# Altium schematic sheet sokolov_control_board_2.SchDoc: =title_line_1 + title_line_2
size 840 x 594 mm; SheetNumber: 2
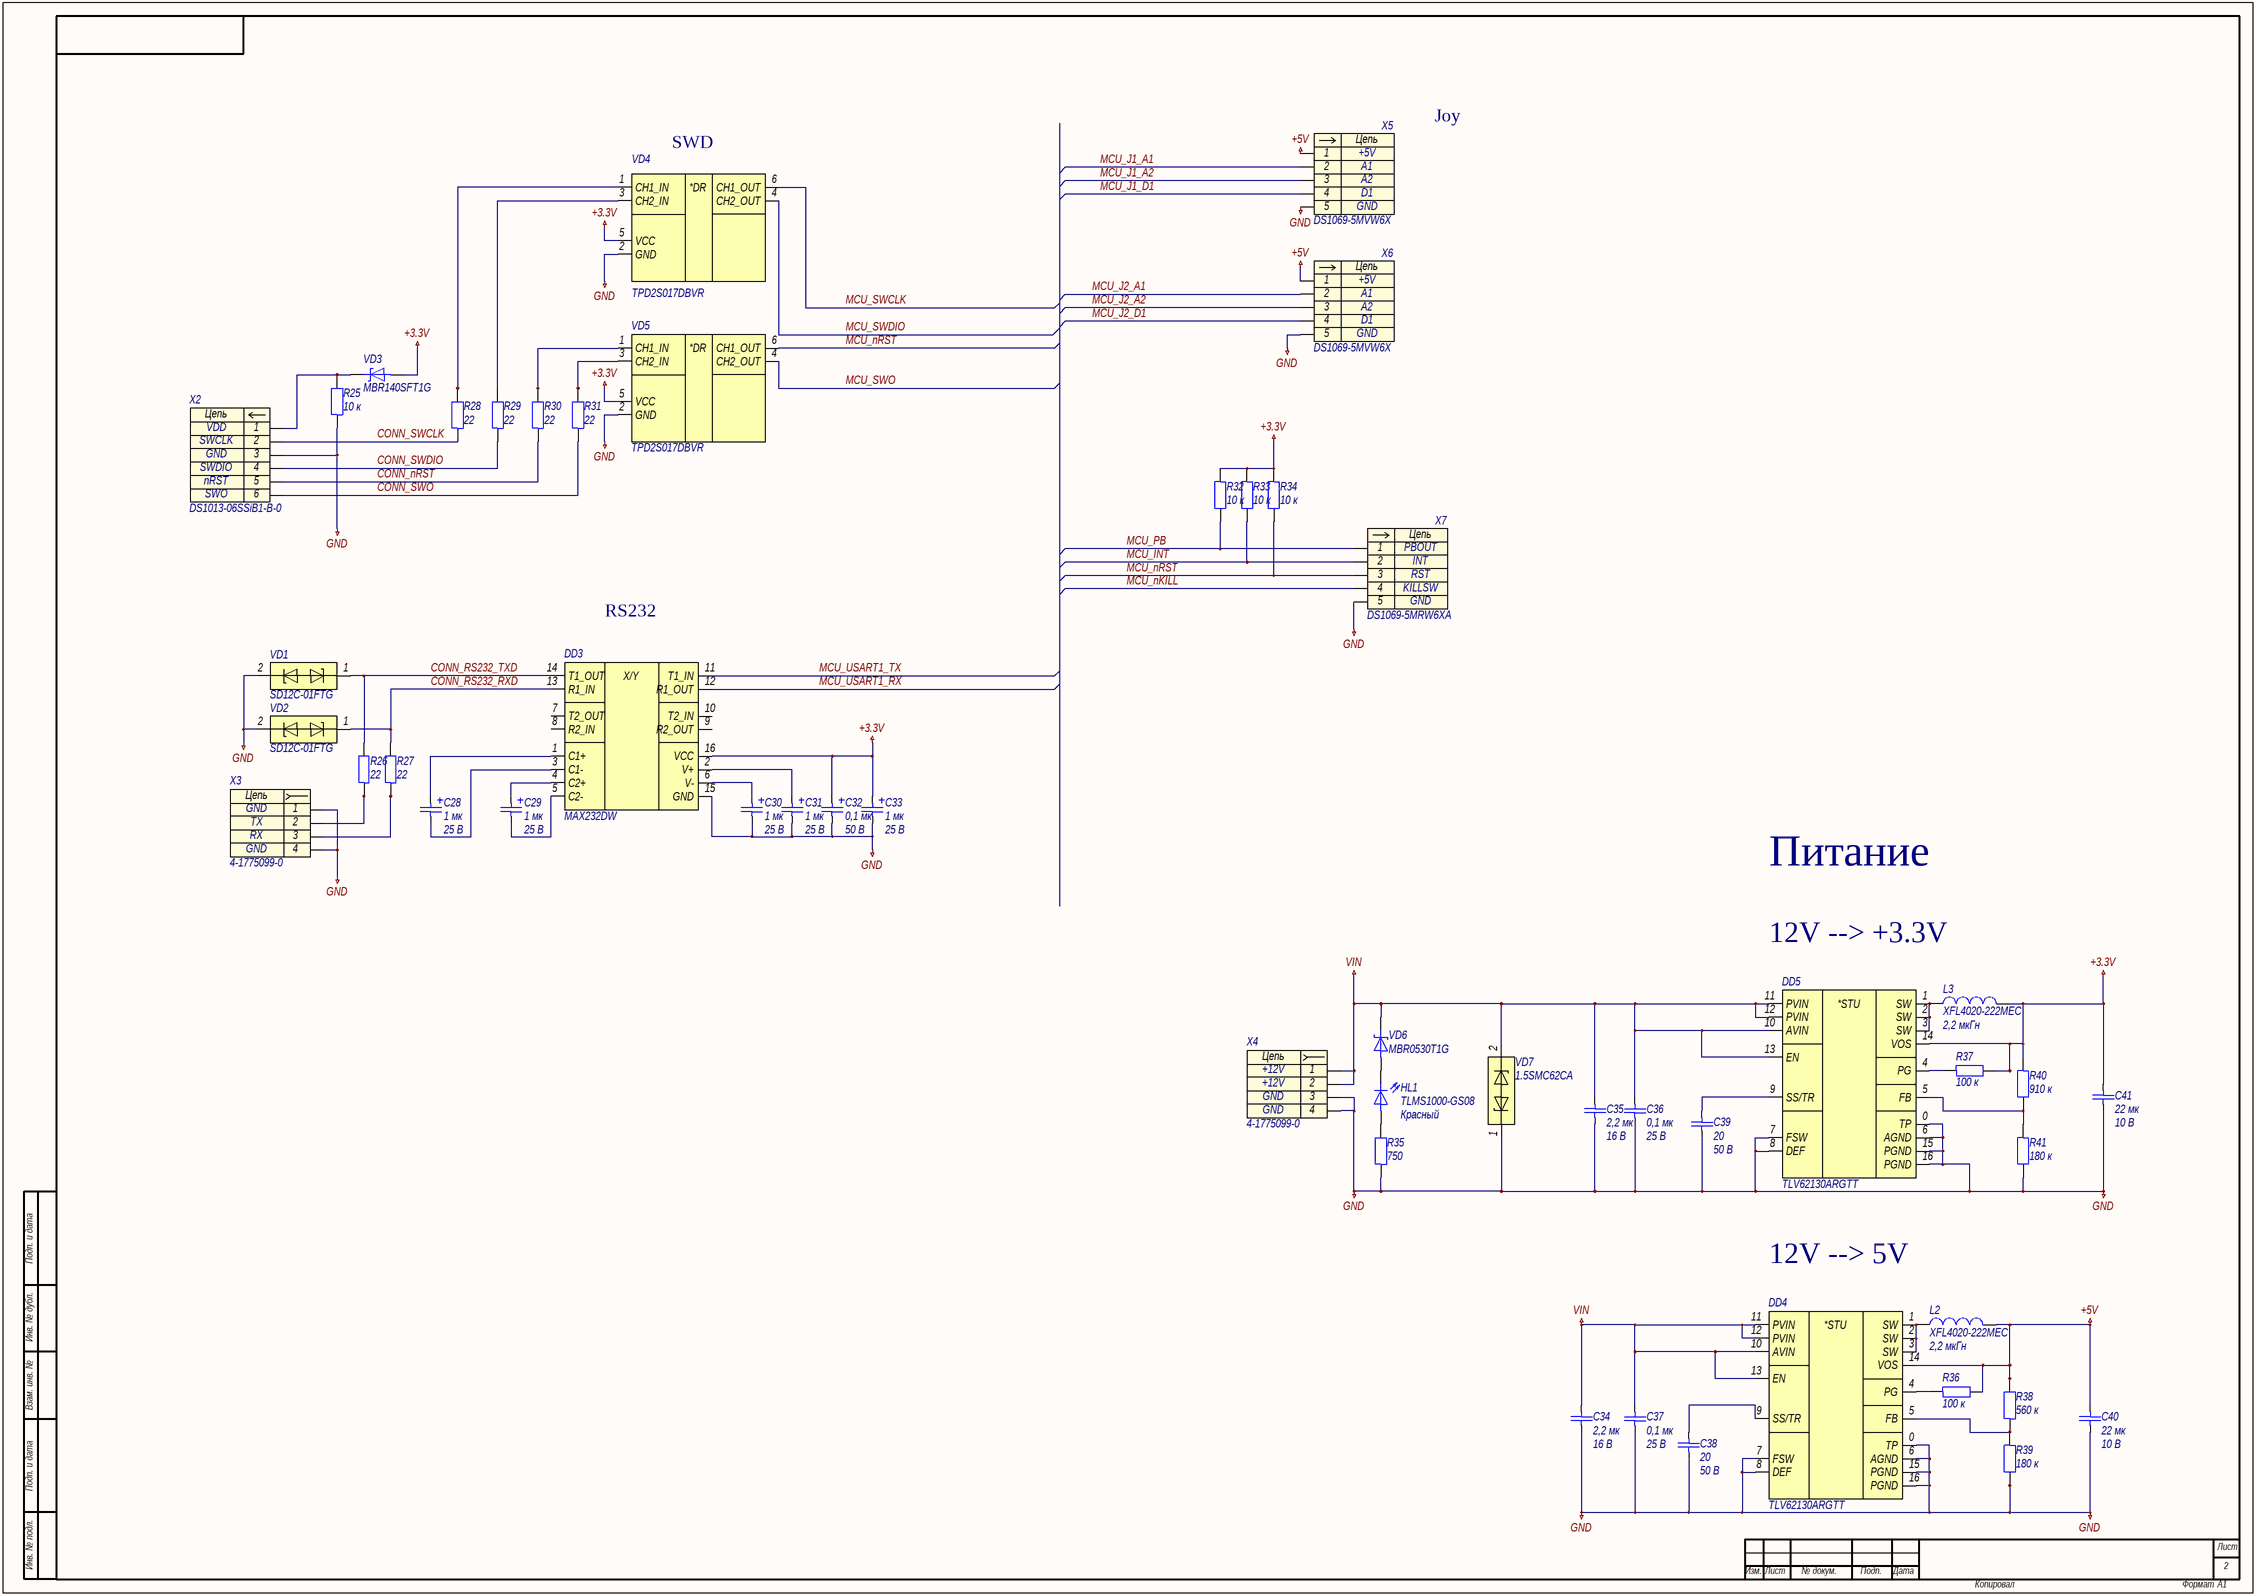
[diagram p0: sokolov_control_board_2.SchDoc]

## Parts
C28  1 мк  Напряжение: 25 В  [C3216-18]
C29  1 мк  Напряжение: 25 В  [C3216-18]
C30  1 мк  Напряжение: 25 В  [C3216-18]
C31  1 мк  Напряжение: 25 В  [C3216-18]
C32  0,1 мк  Напряжение: 50 В  [C3216-18]
C33  1 мк  Напряжение: 25 В  [C3216-18]
C34  2,2 мк  Напряжение: 16 В  [C0603]
C35  2,2 мк  Напряжение: 16 В  [C0603]
C36  0,1 мк  Напряжение: 25 В  [C0603]
C37  0,1 мк  Напряжение: 25 В  [C0603]
C38  20  Напряжение: 50 В  [C0603]
C39  20  Напряжение: 50 В  [C0603]
C40  22 мк  Напряжение: 10 В  [C1206]
C41  22 мк  Напряжение: 10 В  [C1206]
DD3  MAX232DW  [SOIC-16-P127-1030X750X265-L84X41]
DD4  TLV62130ARGTT  [WQFN-16-P50-300X300X100-L40X24-T168X168]
DD5  TLV62130ARGTT  [WQFN-16-P50-300X300X100-L40X24-T168X168]
HL1  TLMS1000-GS08  Цвет: Красный  [HL0603]
L2  XFL4020-222MEC  Индуктивность: 2,2 мкГн  [XFL-2-400X400X210]
L3  XFL4020-222MEC  Индуктивность: 2,2 мкГн  [XFL-2-400X400X210]
R25  10 к  [R0603]
R26  22  [R0603]
R27  22  [R0603]
R28  22  [R0603]
R29  22  [R0603]
R30  22  [R0603]
R31  22  [R0603]
R32  10 к  [R0603]
R33  10 к  [R0603]
R34  10 к  [R0603]
R35  750  [R0603]
R36  100 к  [R0603]
R37  100 к  [R0603]
R38  560 к  [R0603]
R39  180 к  [R0603]
R40  910 к  [R0603]
R41  180 к  [R0603]
VD1  SD12C-01FTG  [SOD-323-257X130X114]
VD2  SD12C-01FTG  [SOD-323-257X130X114]
VD3  MBR140SFT1G  [SOD-123FL-370X165X98]
VD4  TPD2S017DBVR  [SOT-23-6-P95-290X280X145]
VD5  TPD2S017DBVR  [SOT-23-6-P95-290X280X145]
VD6  MBR0530T1G  [SOD-123-368X160X135]
VD7  1.5SMC62CA  [DO-214AB-790X590X262]
X2  DS1013-06SSiB1-B-0  [DS1013-06SSiB1-B-0]
X3  4-1775099-0  [4-1775099-0]
X4  4-1775099-0  [4-1775099-0]
X5  DS1069-5MVW6X  [DS1069-5MVW6X]
X6  DS1069-5MVW6X  [DS1069-5MVW6X]
X7  DS1069-5MRW6XA  [DS1069-5MRW6XA]

## Nets
+3.3V: C32.1 C33.1 C41.2 DD3.16(VCC) DD5.14(VOS) L3.2 R32.1 R33.1 R34.1 R37.2 R40.1 VD3.2 VD4.5(VCC) VD5.5(VCC)
+5V: C40.2 DD4.14(VOS) L2.2 R36.2 R38.2 X5.1 X6.1
GND: C30.2 C31.2 C32.2 C33.2 C34.1 C35.1 C36.2 C37.2 C38.1 C39.1 C40.1 C41.1 DD3.15(GND) DD4.0(TP) DD4.6(AGND) DD4.7(FSW) DD4.8(DEF) DD4.15(PGND) DD4.16(PGND) DD5.0(TP) DD5.6(AGND) DD5.7(FSW) DD5.8(DEF) DD5.15(PGND) DD5.16(PGND) R25.1 R35.1 R39.2 R41.2 VD1.2 VD2.2 VD4.2(GND) VD5.2(GND) VD7.1 X2.3 X3.1 X3.4 X4.3 X4.4 X5.5 X6.5 X7.5
VIN: C34.2 C35.2 C36.1 C37.1 DD4.10(AVIN) DD4.11(PVIN) DD4.12(PVIN) DD4.13(EN) DD5.10(AVIN) DD5.11(PVIN) DD5.12(PVIN) DD5.13(EN) VD6.1 VD7.2 X4.1 X4.2
CONN_nRST: R30.1 X2.5
CONN_RS232_RXD: DD3.13(R1_IN) R27.2 VD2.1
CONN_RS232_TXD: DD3.14(T1_OUT) R26.2 VD1.1
CONN_SWCLK: R28.1 X2.2
CONN_SWDIO: R29.1 X2.4
CONN_SWO: R31.1 X2.6
MCU_INT: R33.2 X7.2
MCU_J1_A1: X5.2
MCU_J1_A2: X5.3
MCU_J1_D1: X5.4
MCU_J2_A1: X6.2
MCU_J2_A2: X6.3
MCU_J2_D1: X6.4
MCU_nKILL: X7.4
MCU_nRST: R34.2 VD5.6(CH1_OUT) X7.3
MCU_PB: R32.2 X7.1
MCU_SWCLK: VD4.6(CH1_OUT)
MCU_SWDIO: VD4.4(CH2_OUT)
MCU_SWO: VD5.4(CH2_OUT)
MCU_USART1_RX: DD3.12(R1_OUT)
MCU_USART1_TX: DD3.11(T1_IN)
NetC28_1: C28.1 DD3.1(C1+)
NetC28_2: C28.2 DD3.3(C1-)
NetC29_1: C29.1 DD3.4(C2+)
NetC29_2: C29.2 DD3.5(C2-)
NetC30_1: C30.1 DD3.6(V-)
NetC31_1: C31.1 DD3.2(V+)
NetC38_2: C38.2 DD4.9(SS/TR)
NetC39_2: C39.2 DD5.9(SS/TR)
NetDD4_1: DD4.1(SW) DD4.2(SW) DD4.3(SW) L2.1
NetDD4_4: DD4.4(PG) R36.1
NetDD4_5: DD4.5(FB) R38.1 R39.1
NetDD5_1: DD5.1(SW) DD5.2(SW) DD5.3(SW) L3.1
NetDD5_4: DD5.4(PG) R37.1
NetDD5_5: DD5.5(FB) R40.2 R41.1
NetHL1_1: HL1.1 VD6.2
NetHL1_2: HL1.2 R35.2
NetR25_2: R25.2 VD3.1 X2.1
NetR26_1: R26.1 X3.2
NetR27_1: R27.1 X3.3
NetR28_2: R28.2 VD4.1(CH1_IN)
NetR29_2: R29.2 VD4.3(CH2_IN)
NetR30_2: R30.2 VD5.1(CH1_IN)
NetR31_2: R31.2 VD5.3(CH2_IN)

Not connected (* = marked no-connect by the designer): DD3 7(T2_OUT) 8(R2_IN) 9(R2_OUT) 10(T2_IN)

## Notes on the sheet
- Joy
- SWD
- RS232
- Питание
- 12V --> +3.3V
- 12V --> 5V
- Подп. и дата
- Инв. № дубл.
- Взам. инв. №
- Инв. № подл.
- Лист
- Изм.
- № докум.
- Подп.
- Дата
- Копировал
- Формат
- А1
- (in symbol dd0014) X/Y
- (in symbol dd0017) *STU
- (in symbol vd0016) *DR
- (in symbol x0006) Цепь
- (in symbol x0022) Цепь
- (in symbol x0046) Цепь
- (in symbol x0047) Цепь

## Library data of the parts
C28-C31 C33 = c0014: =Описание; ID: c0014; Фамилия: Ларионов; Описание: Конденсатор танталовый чип 3216-18 1 мкФ 25 В ±10 %; Наименование: 293D105X9025A2TE3; Производитель: Vishay Intertechnology, Inc.; Отклонение: ±10 %; Эквивалентное последовательное сопротивление: 7,6 Ом; Среднеквадратичный размах пульсации тока: 0,10 А; Рабочие температуры: от –55 °С до +125 °С; Корпус: 3216-18; Номинал: 1 мк; Номинальное напряжение: 25 В; HelpURL: https://www.vishay.com/capacitors/list/product-40002/
C32 = c0001: =Описание; ID: c0001; Фамилия: Ларионов; Описание: Конденсатор танталовый чип 3216-18 100 нФ 50 В ±10 %; Наименование: 293D104X9050A2TE3; Производитель: Vishay Intertechnology, Inc.; Отклонение: ±10 %; Эквивалентное последовательное сопротивление: 19,0 Ом; Среднеквадратичный размах пульсации тока: 0,06 А; Рабочие температуры: от –55 °С до +125 °С; Корпус: 3216-18; Номинал: 0,1 мк; Номинальное напряжение: 50 В; HelpURL: https://www.vishay.com/capacitors/list/product-40002/
C34 C35 = c0126: =Описание; ID: c0126; Фамилия: Паньков; Описание: Конденсатор керамический чип 0603 2,2 мкФ 16 В ±10 %; Наименование: CC0603KRX7R7BB225; Производитель: YAGEO Corp.; Отклонение: ±10 %; Рабочие температуры: от –55 °С до +125 °С; Температурный коэффициент емкости: X7R; Корпус: 0603; Номинал: 2,2 мк; Номинальное напряжение: 16 В; HelpURL: https://www.yageo.com/upload/media/product/productsearch/datasheet/mlcc/UPY-GPHC_X7R_6.3V-to-50V_20.pdf
C36 C37 = c0063: =Описание; ID: c0063; Фамилия: Паньков; Описание: Конденсатор керамический чип 0603 100 нФ 25 В ±10 %; Наименование: CC0603KRX7R8BB104; Производитель: YAGEO Corp.; Отклонение: ±10 %; Рабочие температуры: от –55 °С до +125 °С; Температурный коэффициент емкости: X7R; Корпус: 0603; Номинал: 0,1 мк; Номинальное напряжение: 25 В; HelpURL: https://www.yageo.com/upload/media/product/productsearch/datasheet/mlcc/UPY-GPHC_X7R_6.3V-to-50V_20.pdf
C38 C39 = c0021: =Описание; ID: c0021; Фамилия: Паньков; Описание: Конденсатор керамический чип 0603 20 пФ 50 В ±1 %; Наименование: CC0603FRNPO9BN200; Производитель: YAGEO Corp.; Отклонение: ±1 %; Рабочие температуры: от –55 °С до +125 °С; Температурный коэффициент емкости: C0G; Корпус: 0603; Номинал: 20; Номинальное напряжение: 50 В; HelpURL: https://www.yageo.com/upload/media/product/productsearch/datasheet/mlcc/UPY-GP_NP0_16V-to-50V_18.pdf
C40 C41 = c0159: =Описание; ID: c0159; Фамилия: Паньков; Описание: Конденсатор керамический чип 1206 22 мкФ 10 В ±10 %; Наименование: CC1206KKX5R6BB226; Производитель: YAGEO Corp.; Отклонение: ±10 %; Рабочие температуры: от –55 °С до +85 °С; Температурный коэффициент емкости: X5R; Корпус: 1206; Номинал: 22 мк; Номинальное напряжение: 10 В; HelpURL: https://www.yageo.com/upload/media/product/productsearch/datasheet/mlcc/UPY-GPHC_X5R_4V-to-50V_26.pdf
DD3 = dd0014: =Описание; ID: dd0014; Фамилия: Паньков; Описание: Приемопередатчик RS-232; Производитель: Texas Instruments Inc.; Рабочие температуры: от 0 до +70 °C; Корпус: SOIC-16; Наименование: MAX232DW; HelpURL: https://www.ti.com/product/MAX232
DD4 DD5 = dd0017: =Описание; ID: dd0017; Фамилия: Самарин; Описание: Понижающий преобразователь напряжения 3,0…17 В / 0,9…5,25 В и 3,0 А; Производитель: Texas Instruments Inc.; Входное напряжение: от 3,0 В до 17 В; Выходное напряжение: от 0,9 до 5,25 В; Коммутируемый ток: до 3,0 А; Частота переключения: от 1,25 МГц до 2,5 МГц; Рабочие температуры: от –40 °С до +85 °С; Корпус: WQFN-16; Наименование: TLV62130ARGTT; HelpURL: https://www.ti.com/product/TLV62130
HL1 = hl0001: =Описание; ID: hl0001; Фамилия: Ларионов; Описание: Светодиод чип 0603 красный; Производитель: Vishay Intertechnology, Inc.; Номинальная сила света: 4 мкд; Номинальная длина волны: 628 нм; Номинальный прямой ток: 15 мА; Номинальное падение напряжения: 1,8 В; Рассеиваемая мощность: 40 мВт; Рабочие температуры: от –40 °С до +100 °С; Корпус: 0603; Наименование: TLMS1000-GS08; HelpURL: https://www.vishay.com/leds/list/product-83172/
L2 L3 = l0002: =Описание; ID: l0002; Фамилия: Ларионов; Описание: Катушка индуктивности 2,2 мкГн ±20 %; Производитель: Coilcraft, Inc.; Отклонение: ±20 %; Номинальное активное сопротивление: 21,35 мОм; Максимальное активное сопротивление: 23,5 мОм; Резонансная частота: 38 МГц; Номинальный ток (при нагреве на 20 °С/40 °С): 6 А; Ток насыщения: 3,5 А; Рабочее напряжение: от 0 В до 20 В; Рабочие температуры: от –40 °С до +125 °С; Корпус: 4,0 x 4,0 x 2,1; Наименование: XFL4020-222MEC; Номинал: 2,2 мкГн; HelpURL: https://www.coilcraft.com/en-us/products/power/shielded-inductors/molded-inductor/xfl/xfl4020/
R25 R32-R34 = r0105: =Описание; ID: r0105; Фамилия: Самарин; Описание: Резистор чип 0603 10 кОм ±1 % 0,1 Вт; Наименование: RC0603FR-0710KL; Производитель: YAGEO Corp.; Отклонение: ±1 %; Номинальное напряжение: 75 В; Номинальный ток: 1 А; Рабочие температуры: от –55 °С до +155 °С; Корпус: 0603; Примечание: Ряд E24; Номинал: 10 к; HelpURL: https://www.yageo.com/upload/media/product/productsearch/datasheet/rchip/PYu-RC_Group_51_RoHS_L_11.pdf
R26 R27 = r0004: =Описание; ID: r0004; Фамилия: Ларионов; Описание: Резистор чип 0603 22 Ом ±1 % 0,1 Вт; Наименование: RC0603FR-0722RL; Производитель: YAGEO Corp.; Отклонение: ±1 %; Номинальное напряжение: 75 В; Номинальный ток: 1 А; Рабочие температуры: от –55 °С до +155 °С; Корпус: 0603; Примечание: Ряд E24; Номинал: 22; HelpURL: https://www.yageo.com/upload/media/product/productsearch/datasheet/rchip/PYu-RC_Group_51_RoHS_L_11.pdf
R28-R31 = r0034: =Описание; ID: r0034; Фамилия: Ларионов; Описание: Резистор чип 0603 22 Ом ±1 % 0,1 Вт; Наименование: RC0603FR-0722RL; Производитель: YAGEO Corp.; Отклонение: ±1 %; Номинальное напряжение: 75 В; Номинальный ток: 1 А; Рабочие температуры: от –55 °С до +155 °С; Корпус: 0603; Примечание: Ряд E24; Номинал: 22; HelpURL: https://www.yageo.com/upload/media/product/productsearch/datasheet/rchip/PYu-RC_Group_51_RoHS_L_11.pdf
R35 = r0028: =Описание; ID: r0028; Фамилия: Паньков; Описание: Резистор чип 0603 750 Ом ±1 % 0,1 Вт; Наименование: RC0603FR-07750RL; Производитель: YAGEO Corp.; Отклонение: ±1 %; Номинальное напряжение: 75 В; Номинальный ток: 1 А; Рабочие температуры: от –55 °С до +155 °С; Корпус: 0603; Примечание: Ряд E24; Номинал: 750; HelpURL: https://www.yageo.com/upload/media/product/productsearch/datasheet/rchip/PYu-RC_Group_51_RoHS_L_11.pdf
R36 R37 = r0141: =Описание; ID: r0141; Фамилия: Водорезов; Описание: Резистор чип 0603 100 кОм ±1 % 0,1 Вт; Наименование: RC0603FR-07100KL; Производитель: YAGEO Corp.; Отклонение: ±1 %; Номинальное напряжение: 75 В; Номинальный ток: 1 А; Рабочие температуры: от –55 °С до +155 °С; Корпус: 0603; Примечание: Ряд E24; Номинал: 100 к; HelpURL: https://www.yageo.com/upload/media/product/productsearch/datasheet/rchip/PYu-RC_Group_51_RoHS_L_11.pdf
R38 = r0167: =Описание; ID: r0167; Фамилия: Паньков; Описание: Резистор чип 0603 560 кОм ±1 % 0,1 Вт; Наименование: RC0603FR-07560KL; Производитель: YAGEO Corp.; Отклонение: ±1 %; Номинальное напряжение: 75 В; Номинальный ток: 1 А; Рабочие температуры: от –55 °С до +155 °С; Корпус: 0603; Примечание: Ряд E24; Номинал: 560 к; HelpURL: https://www.yageo.com/upload/media/product/productsearch/datasheet/rchip/PYu-RC_Group_51_RoHS_L_11.pdf
R39 R41 = r0152: =Описание; ID: r0152; Фамилия: Паньков; Описание: Резистор чип 0603 180 кОм ±1 % 0,1 Вт; Наименование: RC0603FR-07180KL; Производитель: YAGEO Corp.; Отклонение: ±1 %; Номинальное напряжение: 75 В; Номинальный ток: 1 А; Рабочие температуры: от –55 °С до +155 °С; Корпус: 0603; Примечание: Ряд E24; Номинал: 180 к; HelpURL: https://www.yageo.com/upload/media/product/productsearch/datasheet/rchip/PYu-RC_Group_51_RoHS_L_11.pdf
R40 = r0172: =Описание; ID: r0172; Фамилия: Паньков; Описание: Резистор чип 0603 910 кОм ±1 % 0,1 Вт; Наименование: RC0603FR-07910KL; Производитель: YAGEO Corp.; Отклонение: ±1 %; Номинальное напряжение: 75 В; Номинальный ток: 1 А; Рабочие температуры: от –55 °С до +155 °С; Корпус: 0603; Примечание: Ряд E24; Номинал: 910 к; HelpURL: https://www.yageo.com/upload/media/product/productsearch/datasheet/rchip/PYu-RC_Group_51_RoHS_L_11.pdf
VD1 VD2 = vd0004: =Описание; ID: vd0004; Фамилия: Ларионов; Описание: Двунаправленная диодная сборка для подавления помех 12 В; Производитель: Littelfuse, Inc.; Корпус: SOD-323; Наименование: SD12C-01FTG; HelpURL: https://www.littelfuse.com/products/tvs-diode-arrays/general-purpose-esd-protection/sdc/sd12c_01ftg.aspx
VD3 = vd0002: =Описание; ID: vd0002; Фамилия: Паньков; Описание: Диод Шоттки 40 В 1 А; Производитель: ON Semiconductor; Максимальное прямое напряжение: 0,88 В; Максимальное обратное напряжение: 40 В; Максимальный прямой ток: 1 А; Рабочие температуры: от –55 °С до +125 °С; Корпус: SOD-123FL; Наименование: MBR140SFT1G; HelpURL: https://www.onsemi.com/products/discretes-drivers/diodes-rectifiers/schottky-diodes-schottky-rectifiers/mbr140sf
VD4 VD5 = vd0016: =Описание; ID: vd0016; Фамилия: Паньков; Описание: Диодная сборка для подавления помех 5 В; Производитель: Texas Instruments Inc.; Корпус: SOT-23-6; Наименование: TPD2S017DBVR; HelpURL: https://www.ti.com/product/TPD2S017
VD6 = vd0001: =Описание; ID: vd0001; Фамилия: Шкабара; Описание: Диод Шоттки 30 В 0,5 А; Производитель: ON Semiconductor; Максимальное прямое напряжение: 0,43 В; Максимальное обратное напряжение: 30 В; Максимальный прямой ток: 0,5 А; Рабочие температуры: от –65 °С до +125 °С; Корпус: SOD-123; Наименование: MBR0530T1G; HelpURL: https://www.onsemi.com/products/discretes-drivers/diodes-rectifiers/schottky-diodes-schottky-rectifiers/mbr0530t1g
VD7 = vd0009: =Описание; ID: vd0009; Фамилия: Ларионов; Описание: Двунаправленная диодная сборка для подавления помех 53 В; Производитель: Littelfuse, Inc.; Корпус: DO-214AB; Наименование: 1.5SMC62CA; HelpURL: https://www.littelfuse.com/products/tvs-diodes/surface-mount/1_5smc.aspx
X2 = x0022: =Описание; Contact_1: VDD; Contact_2: SWCLK; Contact_3: GND; Contact_4: SWDIO; Contact_5: nRST; Contact_6: SWO; ID: x0022; Фамилия: Паньков; Описание: Box Header 6 pin 2,54 мм вилка прямой; Производитель: Connfly Electronic Co., Ltd.; Наименование: DS1013-06SSiB1-B-0; HelpURL: http://en.connfly.group/product/xVkr=EusQssAN0gN=Aos=mU+UrVkR9kqEAN0gN9g+Upc+NB+A
X3 = x0006: =Описание; Contact_1: GND; Contact_2: TX; Contact_3: RX; ID: x0006; Фамилия: Ларионов; Описание: ATX Power 4 pin гнездо прямой; Производитель: TE Connectivity; Contact_4: GND; Наименование: 4-1775099-0; HelpURL: https://www.te.com/usa-en/product-4-1775099-0.html
X4 = x0006: =Описание; Contact_1: +12V; Contact_3: GND; ID: x0006; Фамилия: Ларионов; Описание: ATX Power 4 pin гнездо прямой; Производитель: TE Connectivity; Contact_2: +12V; Contact_4: GND; Наименование: 4-1775099-0; HelpURL: https://www.te.com/usa-en/product-4-1775099-0.html
X5 X6 = x0047: =Описание; Contact_1: +5V; Contact_2: A1; Contact_3: A2; Contact_4: D1; Contact_5: GND; ID: x0047; Фамилия: Паньков; Описание: CWF 5 pin 2,5 мм вилка прямой; Производитель: Connfly Electronic Co., Ltd.; Наименование: DS1069-5MVW6X; HelpURL: http://en.connfly.group/product/xVkr=EusQssAN0gN=Aos=mU+UrVkR9kqEAN0gN0MUR+g+NB+A
X7 = x0046: =Описание; Contact_1: PBOUT; Contact_2: INT; Contact_3: RST; Contact_4: KILLSW; Contact_5: GND; ID: x0046; Фамилия: Паньков; Описание: CWF 5 pin Type A 2,5 мм вилка угловой; Производитель: Connfly Electronic Co., Ltd.; Наименование: DS1069-5MRW6XA; HelpURL: http://en.connfly.group/product/xVkr=EusQssAN0gN=Aos=mU+UrVkR9kqEAN0gN0MUR+g+NB+A